# EasyEDA Pro project KOBE_FOC.epro, board KOBE_PCB_2
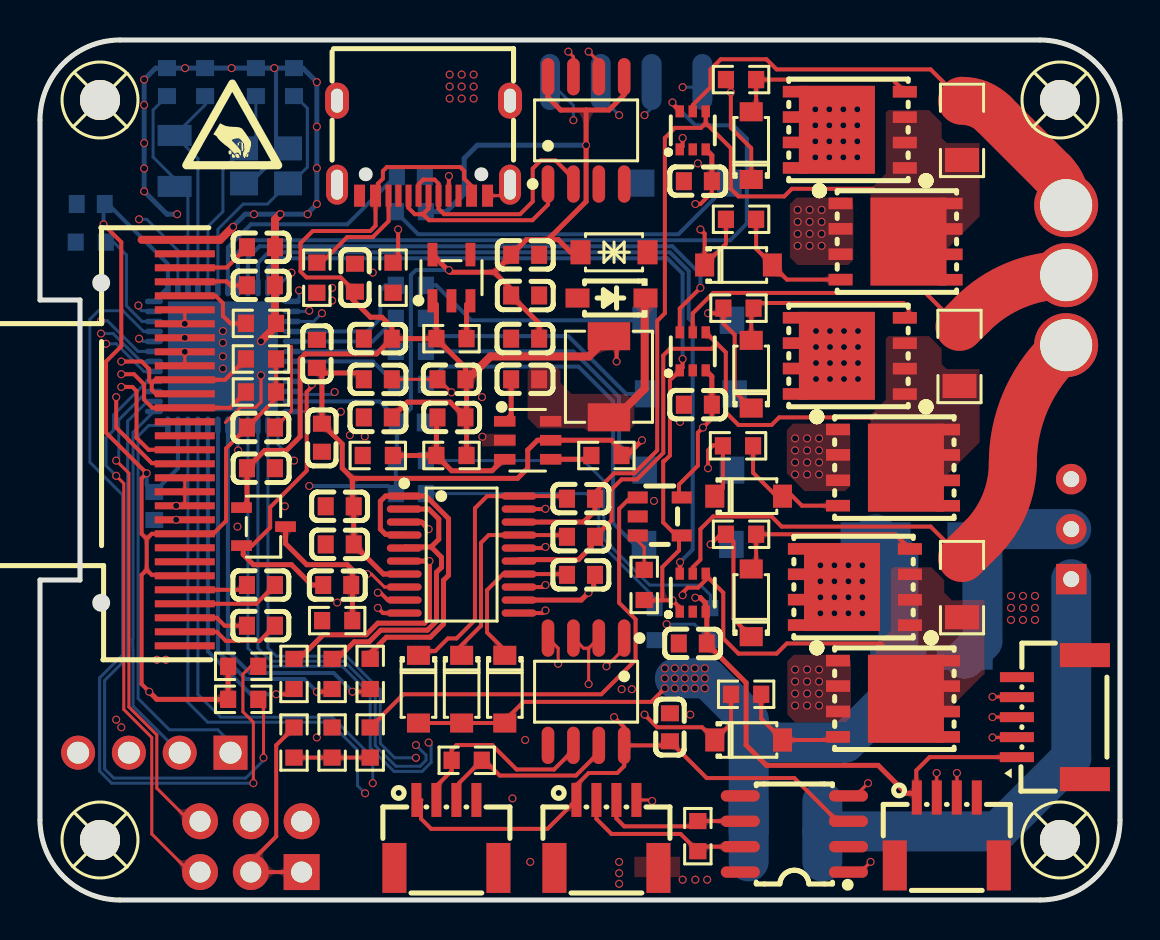
[diagram p1: board, top side]
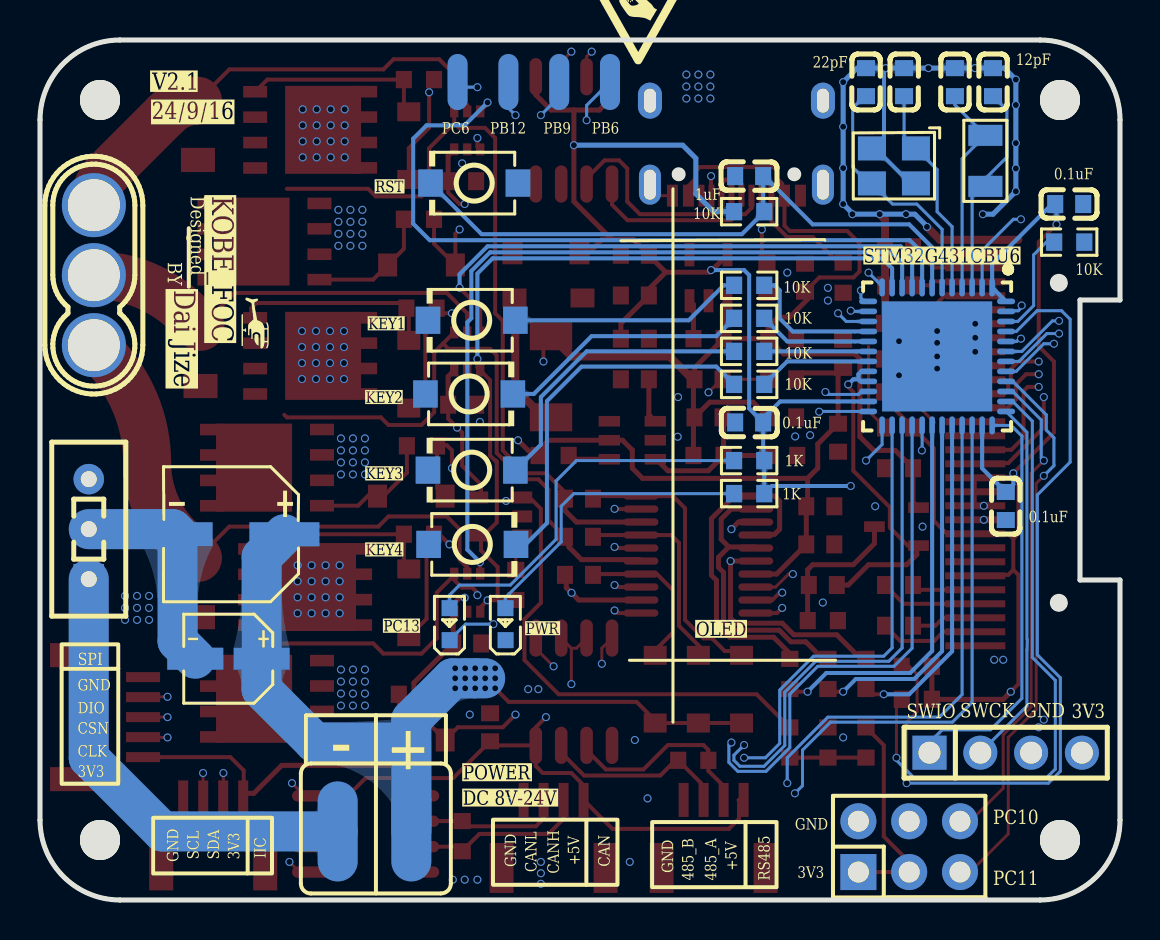
[diagram p2: board, bottom side, seen from below]

Outline 54 x 43 mm; copper layers: Top Layer, Inner1, Inner2, Bottom Layer. Coordinates in mm from the lower left corner of the outline.
Outline path: 0,39 0,30 2,30 2,16 0,16 0,4 arc(1.17,1.17) 4,0 50,0 arc(52.83,1.17) 54,4 54,39 arc(52.83,41.83) 50,43 4,43 arc(1.17,41.83) 0,39
Stack: Top Layer 0.035mm 外层铜厚1oz / Dielectric1 0.48mm 7628 RC49% 8.6mil / Inner1 0.035mm 内层铜厚 / Dielectric2 0.48mm 1.1mm H/HOZ 含铜 / Inner2 0.035mm 内层铜厚 / Dielectric3 0.48mm 7628 RC49% 8.6mil / Bottom Layer 0.035mm 外层铜厚1oz

## Design rules (mm)
template: 自定义配置
spacing copperThickness1oz (default): track to track 0.102, other pairs 0.152 to 0.3
spacing copperThickness2oz: track to track 0.203, other pairs 0.152 to 0.3
track width copperThickness1oz (default): min 0.127, default 0.254, max 2.54
track width copperThickness2oz: min 0.203, default 0.254, max 2.54
differential pair differentialPair (default): width min 0.127, default 0.254, max 2.54; gap min 0.152, default 0.152
via viaSize (default): diameter min 0.4, default 0.4, max 10; hole min 0.3, default 0.3, max 6.3

## Placement (name value [footprint] x y rotation side)
C1  1uF  [C0603]  16.89 28.07 0 top
C2  100nF  [C0603]  15.75 31.11 270 top
C3  100nF  [C0603]  24.26 30.23 180 top
C4  100nF  [C0603]  14.86 15.75 180 top
C5  100nF  [C0603]  11.05 21.59 180 top
C6  100nF  [C0603]  24.26 32.26 180 top
C7  1uF  [C0603]  11.05 13.72 0 top
C8  1uF  [C0603]  11.05 15.75 0 top
C9  1uF  [C0603]  11.05 23.62 0 top
C10  2.2uF  [C0603]  11.05 30.73 180 top
C11  2.2uF  [C0603]  11.05 32.64 180 top
C12  100nF  [C0603]  31.5 8.64 270 top
C13  1uF  [C0603]  18.54 36.19 180 bottom
C14  12pF  [C0603]  6.35 40.89 270 bottom
C15  12pF  [C0603]  8.25 40.89 270 bottom
C16  22pF  [C0603]  10.79 40.89 270 bottom
C17  22pF  [C0603]  12.7 40.89 270 bottom
C22  1uF  [C0603]  24.26 28.07 0 top
C27  100uF  [CAP-SMD_BD6.3-L6.6-W6.6-LS7.2-FD]  44.45 18.29 0 bottom
C28  10uF  [CAP-SMD_BD4.0-L4.3-W4.3-LS5.0-FD]  44.58 12.06 0 bottom
C29  100nF  [C0603]  14.1 23.11 90 top
C30  4.7uF  [C0603]  13.84 27.31 270 top
C31  100nF  [C0603]  27.05 20.07 0 top
C32  100nF  [C0603]  27.05 18.16 0 top
C33  100nF  [C0603]  27.05 16.26 0 top
C34  100nF  [C0603]  14.99 19.69 0 top
C35  100nF  [C0603]  14.99 17.78 0 top
C36  100nF  [C0603]  32.89 35.94 0 top
C37  100nF  [C0603]  32.89 24.77 0 top
C38  100nF  [C0603]  32.64 12.83 0 top
C39  100nF  [C0603]  20.57 26.03 0 top
C48  1uF  [C0603]  24.26 26.03 0 top
C49  47pF  [C0603]  20.57 24.13 180 top
C50  22uF  [C0603]  16.89 24.13 180 top
C51  2.2uF  [C0603]  16.89 26.03 180 top
C52  100nF  [C0603]  2.54 34.8 180 bottom
C53  100nF  [C0603]  18.54 23.88 0 bottom
C54  100nF  [C0603]  5.71 19.7 90 bottom
CN2  WAFER-SH1.0-4PWB  [CONN-SMD_4P-P1.00_WAFER-SH1.0-4PWB]  45.34 3.43 0 top
CN3  WAFER-SH1.0-4PWB  [CONN-SMD_4P-P1.00_WAFER-SH1.0-4PWB]  20.32 3.3 0 top
CN4  WAFER-SH1.0-4PWB  [CONN-SMD_4P-P1.00_WAFER-SH1.0-4PWB]  28.32 3.3 0 top
D1  SMFJ3.3CA  [SOD-123_L2.7-W1.6-LS3.7-BI]  28.7 32.39 180 top
D2  1N4148W  [SOD-123_L2.8-W1.8-LS3.7-RD]  34.93 31.75 0 top
D3  1N4148W  [SOD-123_L2.8-W1.8-LS3.7-RD]  35.56 37.72 90 top
D4  1N4148W  [SOD-123_L2.8-W1.8-LS3.7-RD]  35.56 26.29 90 top
D5  1N4148W  [SOD-123_L2.8-W1.8-LS3.7-RD]  35.43 20.19 0 top
D6  1N4148W  [SOD-123_L2.8-W1.8-LS3.7-RD]  35.56 14.86 90 top
D7  1N4148W  [SOD-123_L2.8-W1.8-LS3.7-RD]  35.43 8 0 top
D8  FR107  [SOD-123_L2.8-W1.8-LS3.7-RD]  23.24 10.54 270 top
D9  FR107  [SOD-123_L2.8-W1.8-LS3.7-RD]  21.08 10.54 270 top
D10  FR107  [SOD-123_L2.8-W1.8-LS3.7-RD]  18.92 10.54 270 top
D11  1N5819W  [SOD-123_L2.7-W1.6-LS3.7-RD-1]  28.57 30.1 180 top
H9  PZ254V-11-04P  [HDR-TH_4P-P2.54-V-M]  5.72 7.37 180 bottom
J1  2.54-2*3P针  [HDR-TH_6P-P2.54-V-M-R2-C3-S2.54-1]  10.54 2.67 180 bottom
L2  6.8uH  [IND-SMD_L4.4-W4.2]  28.45 26.16 270 top
LDO1  ME6211C33M5G-N  [SOT-23-5_L3.0-W1.7-P0.95-LS2.8-BL]  20.57 31.11 0 top
LED1  -  [LED_0603]  33.53 13.84 90 bottom
LED2  -  [LED_0603]  30.73 13.84 90 bottom
NOREF  -  [Pad_e129]  35.43 3.43 0 top
NOREF#2  -  [Pad_e14806]  30.58 40.9 0 top
NOREF#3  -  [Pad_e128]  39.12 3.43 0 top
NOREF#4  -  [Pad_e14808]  25.5 40.9 0 top
NOREF#5  -  [Pad_e988]  33.12 40.9 0 top
NOREF#6  -  [Pad_e14807]  28.04 40.9 0 top
OLED1  N096-2864KSWEG01-H30  [OLED_0.96-30P-P0.70-12864]  7.24 22.86 90 top
Q1  IRFH7440TRPBF  [DFN-8_L5.8-W4.9-P1.27-LS6.0-BL-1]  40.49 38.51 90 top
Q2  IRFH7440TRPBF  [DFN-8_L5.8-W4.9-P1.27-LS6.0-BL-1]  42.78 32.92 270 top
Q3  IRFH7440TRPBF  [DFN-8_L5.8-W4.9-P1.27-LS6.0-BL-1]  40.49 27.21 90 top
Q4  IRFH7440TRPBF  [DFN-8_L5.8-W4.9-P1.27-LS6.0-BL-1]  42.65 21.62 270 top
Q5  IRFH7440TRPBF  [DFN-8_L5.8-W4.9-P1.27-LS6.0-BL-1]  40.75 15.65 90 top
Q6  IRFH7440TRPBF  [DFN-8_L5.8-W4.9-P1.27-LS6.0-BL-1]  42.65 10.06 270 top
R1  1K  [R0603]  18.54 20.32 0 bottom
R2  0Ω  [R0603]  14.86 13.97 0 top
R3  5K1  [R0603]  13.84 31.11 90 top
R4  5K1  [R0603]  17.65 31.11 90 top
R5  10K  [R0603]  11.05 25.4 0 top
R6  10K  [R0603]  11.05 27.05 0 top
R7  910K  [R0603]  11.05 28.83 180 top
R8  120R  [R0603]  21.34 6.98 0 top
R9  10K  [R0603]  18.54 34.42 0 bottom
R10  10K  [R0603]  2.54 32.89 0 bottom
R11  1K  [R0603]  18.54 21.97 0 bottom
R12  10K  [R0603]  18.54 30.73 0 bottom
R13  10K  [R0603]  18.54 27.43 0 bottom
R14  10K  [R0603]  18.54 29.08 180 bottom
R15  10K  [R0603]  18.54 25.78 180 bottom
R16  10K  [R0603]  10.16 10.03 180 top
R17  10K  [R0603]  10.16 11.68 180 top
R18  10K  [R0603]  20.57 28.07 0 top
R22  采样电阻  [R1206]  46.1 38.48 90 top
R23  10K  [R0603]  12.7 7.87 90 top
R24  10K  [R0603]  14.6 7.87 270 top
R25  采样电阻  [R1206]  45.97 27.18 90 top
R26  采样电阻  [R1206]  46.1 15.62 90 top
R27  20R  [R0603]  35.05 41.02 0 top
R28  20R  [R0603]  35.05 34.04 0 top
R29  20R  [R0603]  34.93 29.59 0 top
R30  20R  [R0603]  34.9 22.71 0 top
R31  20R  [R0603]  35.05 18.29 0 top
R32  20R  [R0603]  35.31 10.29 0 top
R33  100R  [R0603]  16.51 11.3 90 top
R34  100R  [R0603]  14.6 11.3 90 top
R35  100R  [R0603]  12.7 11.3 90 top
R36  120R  [R0603]  32.89 3.19 270 top
R39  5.1kΩ  [R0603]  20.57 22.22 180 top
R40  1kΩ  [R0603]  16.89 22.22 0 top
R41  1MΩ  [R0603]  28.32 22.22 180 top
R42  10K  [R0603]  16.51 7.87 270 top
R43  10K  [R0603]  30.21 15.75 90 top
SW1  TS-1088R-02026  [SW-SMD_L3.9-W3.0-P4.45]  32.42 28.99 0 bottom
SW2  TS-1088R-02026  [SW-SMD_L3.9-W3.0-P4.45]  32.54 25.3 180 bottom
SW3  TS-1088R-02026  [SW-SMD_L3.9-W3.0-P4.45]  32.42 21.49 0 bottom
SW4  TS-1088R-02026  [SW-SMD_L3.9-W3.0-P4.45]  32.38 17.78 180 bottom
SW5  TS-1088R-02026  [SW-SMD_L3.9-W3.0-P4.45]  32.29 35.84 0 bottom
SW6  KH-SS12D01-G3-5.0  [SW-TH_KH-SS12D01-G3-5.0]  51.56 18.54 90 bottom
TP1  -  [M2螺丝]  3 3 0 top
TP2  -  [M2螺丝]  3 40 0 top
TP3  -  [M2螺丝]  51 3 0 top
TP4  -  [M2螺丝]  51 40 0 top
U1  EG2133  [TSSOP-20_L6.5-W4.4-P0.65-LS6.4-BL]  21.08 17.27 270 top
U2  BL3085(I47)  [SOP-8_L4.9-W3.9-P1.27-LS6.0-BL]  27.31 10.41 180 top
U4  WAFER-SH1.0-5PWB  [CONN-SMD_5P-P1.00_XUNPU_WAFER-SH1.0-5PWB]  50.55 9.14 90 top
U6  REF3033AIDBZR  [SOT-23-3_L3.0-W1.7-P0.95-LS2.9-BR]  11.18 18.67 180 top
U7  CH340N  [SOP-8_L4.9-W3.9-P1.27-LS6.0-BL]  27.31 38.48 0 top
U11  INA199A1DCKR  [SC-70-6_L2.2-W1.3-P0.65-LS2.1-BR]  32.64 27.43 270 top
U12  INA199A1DCKR  [SC-70-6_L2.2-W1.3-P0.65-LS2.1-BR]  32.64 15.37 270 top
U13  INA199A1DCKR  [SC-70-6_L2.2-W1.3-P0.65-LS2.1-BR]  32.64 38.48 270 top
U14  TJA1050T/CM,118  [SOIC-8_L5.0-W4.0-P1.27-LS6.0-BL]  37.72 3.3 90 top
U15  MR30-M  [CONN-TH_MR30-M]  51.31 31.24 90 bottom
U16  ME3116AM6G  [SOT-23-6_L2.9-W1.6-P0.95-LS2.8-BL]  24.38 22.99 270 top
U17  STM32G431CBU6  [UFQFPN-48_L7.0-W7.0-P0.50-BL-EP]  9.14 27.18 0 bottom
U18  LM321MFX  [SOT-23-5_L2.9-W1.6-P0.95-LS2.8-BL]  30.99 19.18 270 top
USB1  TYPE-C 16PIN 2MD(073)  [USB-C-SMD_TYPE-C-6PIN-2MD-073]  19.18 37.59 180 top
X1  8MHz  [OSC-SMD_4P-L3.2-W2.5-BL]  11.3 36.7 0 bottom
X2  32.768kHz  [OSC-SMD_L3.2-W1.5]  6.73 36.96 90 bottom

## Footprints (pads in the part's own frame, mm; a bottom-side part is the same pattern mirrored in y, then rotated)
C0603
  rect 0.8x0.9 smd: 1(-0.7,0) 2(0.7,0)
CAP-SMD_BD4.0-L4.3-W4.3-LS5.0-FD
  rect 2.8x1.1 smd: 1(-1.661,0) 2(1.661,0)
CAP-SMD_BD6.3-L6.6-W6.6-LS7.2-FD
  rect 3.5x1.2 smd: 1(-2.67,0) 2(2.67,0)
CONN-SMD_4P-P1.00_WAFER-SH1.0-4PWB
  rect 0.5x1.7 smd: 1(-1.5,1.7) 2(-0.5,1.7) 3(0.5,1.7) 4(1.5,1.7)
  rect 1.2x2.5 smd: 5(-2.6,-1.7) 6(2.6,-1.7)
CONN-SMD_5P-P1.00_XUNPU_WAFER-SH1.0-5PWB
  rect 0.5x1.7 smd: 1(-2,1.7) 2(-1,1.7) 3(0,1.7) 4(1,1.7) 5(2,1.7)
  rect 1.2x2.5 smd: 6(3.1,-1.7) 7(-3.1,-1.7)
CONN-TH_MR30-M
  round 3.2 hole 2.6: 1(-3.5,0) 2(0,0) 3(3.5,0)
DFN-8_L5.8-W4.9-P1.27-LS6.0-BL-1
  rect 0.58x1.2 smd: 1(-1.907,-2.75) 2(-0.637,-2.75) 3(0.632,-2.75) 4(1.903,-2.75) 5(1.907,2.75) 6(0.637,2.75) 7(-0.632,2.75) 8(-1.903,2.75)
  rect 4.4x3.8 smd: 9(0,0.646)
HDR-TH_4P-P2.54-V-M
  rect 1.7x1.7 hole 1.1: 1(-3.81,0)
  round 1.7 hole 1.1: 2(-1.27,0) 3(1.27,0) 4(3.81,0)
HDR-TH_6P-P2.54-V-M-R2-C3-S2.54-1
  rect 1.8x1.8 hole 1.05: 1(-2.54,-1.27)
  round 1.8 hole 1.05: 2(-2.54,1.27) 3(0,-1.27) 4(0,1.27) 5(2.54,-1.27) 6(2.54,1.27)
IND-SMD_L4.4-W4.2
  rect 1.4x2.12 smd: 1(2.028,0) 2(-2.028,0)
LED_0603
  rect 0.8x0.8 smd: 1(-0.851,-0.01) 2(0.75,-0.005)
M2螺丝
  round 2 hole 2: 1(0,0)
OLED_0.96-30P-P0.70-12864
  rect 0.35x3 smd: 1(-10.15,0.003) 2(-9.45,0.001) 3(-8.75,0.001) 4(-8.05,0.001) 5(-7.35,0.001) 6(-6.65,0.001) 7(-5.95,0.001) 8(-5.25,0.001) 9(-4.55,0.001) 10(-3.85,0.001) 11(-3.15,0.001) 12(-2.45,0.001) 13(-1.75,0.001) 14(-1.05,0.001) 15(-0.35,0.001) 16(0.35,0.001) 17(1.05,0.001) 18(1.75,0.001) 19(2.45,0.001) 20(3.15,0.001) 21(3.85,0.001) 22(4.55,0.001) 23(5.25,0.001) 24(5.95,0.001) 25(6.65,0.001) 26(7.35,0.001) 27(8.05,0.001) 28(8.75,-0.002) 29(9.45,-0.003) 30(10.15,-0.003)
OSC-SMD_4P-L3.2-W2.5-BL
  rect 1.4x1.2 smd: 1(-1.1,-0.875) 2(1.1,-0.875) 3(1.1,0.875) 4(-1.1,0.875)
OSC-SMD_L3.2-W1.5
  rect 1.05x1.7 smd: 1(-1.275,0) 2(1.275,0)
Pad_e128
  oval 2x5 smd far side: 1(0,0)
Pad_e129
  oval 2x5 smd far side: 1(0,0)
Pad_e988
  oval 1x2.8 smd far side: 66(0,0)
Pad_e14806
  oval 1x2.8 smd far side: 66(0,0)
Pad_e14807
  oval 1x2.8 smd far side: 67(0,0)
Pad_e14808
  oval 1x2.8 smd far side: 68(0,0)
R0603
  rect 0.806x0.864 smd: 1(-0.753,0) 2(0.753,0)
R1206
  rect 1.208x1.701 smd: 1(-1.479,0) 2(1.479,0)
SC-70-6_L2.2-W1.3-P0.65-LS2.1-BR
  rect 0.6x0.42 smd: 1(0.95,-0.65) 2(0.95,0) 3(0.95,0.65) 4(-0.95,0.65) 5(-0.95,0) 6(-0.95,-0.65)
SOD-123_L2.7-W1.6-LS3.7-BI
  rect 1x1.2 smd: 1(-1.675,0) 2(1.675,0)
SOD-123_L2.7-W1.6-LS3.7-RD-1
  rect 1.2x0.95 smd: 1(-1.7,0) 2(1.7,0)
SOD-123_L2.8-W1.8-LS3.7-RD
  rect 0.95x1.15 smd: 1(-1.692,0) 2(1.692,0)
SOIC-8_L5.0-W4.0-P1.27-LS6.0-BL
  oval 0.569x1.95 smd: 1(-1.905,-2.705) 2(-0.635,-2.705) 3(0.635,-2.705) 4(1.905,-2.705) 5(1.905,2.705) 6(0.635,2.705) 7(-0.635,2.705) 8(-1.905,2.705)
SOP-8_L4.9-W3.9-P1.27-LS6.0-BL
  oval 0.63x1.865 smd: 1(-1.905,-2.683) 2(-0.635,-2.683) 3(0.635,-2.683) 4(1.905,-2.683) 5(1.905,2.683) 6(0.635,2.683) 7(-0.635,2.683) 8(-1.905,2.683)
SOT-23-3_L3.0-W1.7-P0.95-LS2.9-BR
  rect 1.038x0.532 smd: 1(1.101,-0.95) 2(1.101,0.95) 3(-1.101,0)
SOT-23-5_L2.9-W1.6-P0.95-LS2.8-BL
  rect 0.6x1 smd: 1(-0.95,-1.1) 2(0,-1.1) 3(0.95,-1.1) 4(0.95,1.1) 5(-0.95,1.1)
SOT-23-5_L3.0-W1.7-P0.95-LS2.8-BL
  rect 0.49x1.157 smd: 1(-0.95,-1.153) 2(0,-1.153) 3(0.95,-1.153)
  rect 0.49x1.175 smd: 4(0.95,1.153) 5(-0.95,1.153)
SOT-23-6_L2.9-W1.6-P0.95-LS2.8-BL
  rect 0.532x1.072 smd: 1(-0.95,-1.149) 2(0,-1.149) 3(0.95,-1.149) 4(0.95,1.149) 5(0,1.149) 6(-0.95,1.149)
SW-SMD_L3.9-W3.0-P4.45
  rect 1.23x1.36 smd: 1(-2.185,0) 2(2.185,0)
SW-TH_KH-SS12D01-G3-5.0
  rect 1.524x1.524 hole 0.8: 1(-2.5,0)
  round 1.524 hole 0.8: 2(0,0) 3(2.5,0)
TSSOP-20_L6.5-W4.4-P0.65-LS6.4-BL
  oval 0.364x1.742 smd: 1(-2.925,-2.871) 2(-2.275,-2.871) 3(-1.625,-2.871) 4(-0.975,-2.871) 5(-0.325,-2.871) 6(0.325,-2.871) 7(0.975,-2.871) 8(1.625,-2.871) 9(2.275,-2.871) 10(2.925,-2.871) 11(2.925,2.871) 12(2.275,2.871) 13(1.625,2.871) 14(0.975,2.871) 15(0.325,2.871) 16(-0.325,2.871) 17(-0.975,2.871) 18(-1.625,2.871) 19(-2.275,2.871) 20(-2.925,2.871)
UFQFPN-48_L7.0-W7.0-P0.50-BL-EP
  oval 0.28x0.9 smd: 1(-2.751,-3.45) 2(-2.251,-3.45) 3(-1.75,-3.45) 4(-1.25,-3.45) 5(-0.749,-3.45) 6(-0.249,-3.45) 7(0.249,-3.45) 8(0.75,-3.45) 9(1.25,-3.45) 10(1.75,-3.45) 11(2.251,-3.45) 12(2.751,-3.45) 25(2.751,3.449) 26(2.251,3.449) 27(1.75,3.449) 28(1.25,3.449) 29(0.75,3.449) 30(0.249,3.449) 31(-0.249,3.449) 32(-0.749,3.449) 33(-1.25,3.449) 34(-1.75,3.449) 35(-2.251,3.449) 36(-2.751,3.449)
  oval 0.9x0.28 smd: 13(3.45,-2.751) 14(3.45,-2.251) 15(3.45,-1.75) 16(3.45,-1.25) 17(3.45,-0.75) 18(3.45,-0.249) 19(3.45,0.249) 20(3.45,0.749) 21(3.45,1.25) 22(3.45,1.75) 23(3.45,2.251) 24(3.45,2.751) 37(-3.449,2.751) 38(-3.449,2.251) 39(-3.449,1.75) 40(-3.449,1.25) 41(-3.449,0.749) 42(-3.449,0.249) 43(-3.449,-0.249) 44(-3.449,-0.75) 45(-3.449,-1.25) 46(-3.449,-1.75) 47(-3.449,-2.251) 48(-3.449,-2.751)
  rect 5.5x5.5 smd: 49(0,0)
USB-C-SMD_TYPE-C-6PIN-2MD-073
  rect 0.55x1.1 smd: 1(-3.2,2.375) 2(-2.4,2.375) 11(2.4,2.375) 12(3.2,2.375)
  rect 0.3x1.1 smd: 3(-1.75,2.375) 4(-1.25,2.375) 5(-0.75,2.375) 6(-0.25,2.375) 7(0.25,2.375) 8(0.75,2.375) 9(1.25,2.375) 10(1.75,2.375)
  oval 1.1x2 hole 0.6x1.5: 13(-4.325,1.825) 14(4.325,1.825)
  oval 1.2x1.8 hole 0.6x1.2: 13(-4.325,-2.375) 14(4.325,-2.375)

## Nets
As in the schematic, except:
IN_GND: NOREF#3.1 SW6.1
PB6: NOREF#4.68 U17.44
PB9: NOREF#6.67 U17.47
PB12: NOREF#2.66 U17.25
PC6: NOREF#5.66 U17.29
VM: C27.1 C28.1 C29.2 C30.2 C34.2 C35.2 C51.2 D8.2 D9.2 D10.2 NOREF.1 Q1.5 Q1.6 Q1.7 Q1.8 Q1.9 Q3.5 Q3.6 Q3.7 Q3.8 Q3.9 Q5.5 Q5.6 Q5.7 Q5.8 Q5.9 R41.1 U1.7 U16.5

Pads without a net: LDO1 4; TP1 1; TP2 1; TP3 1; TP4 1; U7 4; U14 5; USB1 3 9

## Via types
v1: diameter 0.4, hole 0.3, Top Layer to Bottom Layer, 262 vias

## Routing (per net, layer and track width the routed paths; a pad name or vN(x,y) marks a point on that pad's centre or on a via; arc(x,y) is an arc through that point)
1V65: length 3.8
  Top Layer w0.2: R42.2 R24.2 R23.1
+3.3V: length 229
  Top Layer w0.2: R6.2 R5.2 11.8,25.08 9.3,22.58 9.3,18.96 8.66,18.31 OLED1.9 5.59,18.31 5.33,18.06 ; 5.33,16.51 5.08,16.26 5.08,10.8 v1(5.46,10.41) ; 5.33,16.51 5.33,18.06 ; 5.33,16.51 5.59,16.26 7.19,16.26 OLED1.6 ; R23.2 11.81,7.74 11.81,3.17 10.03,1.4 12.57,1.4 ; 31.95,19.99 31.95,20.77 32.89,21.72 32.89,23.37 v1(33.15,23.62) 33.59,24.07 C37.2 ; U4.1 44.48,7.14 43.81,6.48 43.81,5.15 ; 5.33,18.06 5.08,18.31 5.08,21.08 v1(5.33,21.34) 3.3,23.37 3.3,26.92 4.06,27.69 4.06,32.89 3.3,33.66 3.17,33.66 ; v1(32.77,34.8) 33.02,34.8 33.59,35.37 C36.2
  Top Layer w0.25: v1(32.77,15.11) 33.02,15.11 33.27,14.86 33.27,14.43 33.34,14.37 C38.2 35.31,10.86 35.31,7.75 36.32,6.73 41.91,6.73 43.31,5.33 43.63,5.33 CN2.1 ; C22.2 24.96,28.83 23.56,30.23 23.56,30.55 22.71,31.39 ; LDO1.5 20.5,31.39 22.71,31.39 ; 22.71,31.39 23.56,32.23 23.56,32.26 24.32,33.02 25.4,33.02 ; 25.4,33.02 27.31,34.92 v1(27.31,37.74) 27.31,39.49 27.31,39.5 ; 25.4,33.02 25.91,33.02 26.54,32.39 D1.2 ; U7.8 25.4,40.13 26.03,39.5 27.31,39.5 ; 27.31,39.5 28.45,39.5 29.21,40.26 U7.5 ; C37.2 33.59,26.18 33.29,26.48 ; C36.2 33.59,37.23 33.29,37.53 ; R17.2 R16.2 5.84,10.03 v1(5.46,10.41)
  Inner1 w0.2: v1(13.46,20.7) 5.97,20.7 v1(5.33,21.34) ; v1(32.77,15.11) 34.04,16.38 34.04,20.07 32.95,21.16 32.95,23.42 v1(33.15,23.62) 33.15,25.02 32.38,25.78 29.08,25.78 28.19,26.67 28.19,27.43 29.08,28.32 33.53,28.32 34.54,29.34 34.54,33.02 v1(32.77,34.8) ; v1(5.46,10.41) 3.17,10.41 1.91,9.14 H9.4 1.91,6.22 5.46,2.67 8.76,2.67 10.03,1.4
  Inner1 w0.25: v1(32.77,34.8) 29.82,37.74 v1(27.31,37.74)
  Bottom Layer w0.2: v1(20.45,31.5) 18.8,31.5 18.54,31.24 18.54,24.58 C53.1 ; U17.35 6.89,21.58 C54.2 5.33,20.78 v1(5.33,21.34) ; C53.1 17.84,22.02 R11.1 R1.1 17.41,20.7 v1(13.46,20.7) ; C53.1 17.84,24.08 16.99,24.93 U17.23 ; U17.48 U17.1 6.39,31.8 3.4,34.8 3.11,34.8 3.17,34.74 v1(3.17,33.78)
  Bottom Layer w0.25: R9.2 20.32,34.42 21.21,35.31 21.21,37.08 21.87,37.74 v1(27.31,37.74)
+5V: length 117.4
  Top Layer w0.2: USB1.2 21.58,35.7 21.21,36.07 21.21,36.45 21.01,36.65 17.34,36.65 17.15,36.45 17.15,36.07 16.89,35.81 16.89,35.33 USB1.11 16.78,33.71 16.51,33.45 13.64,33.45 13.03,32.84 13.03,31.42 13.32,31.13 15.03,31.13 15.75,30.42 ; U2.8 31.29,7.73 C12.2 33.34,6.1 37.72,6.1 39.88,3.94 40.42,3.94 ; U2.8 29.21,8.64 v1(28.7,9.14) ; U2.8 29.21,6.7 28.86,6.35 27.43,6.35 26.82,5.74 CN4.1 25.38,3.56 19.56,3.56 19.05,4.06 19.05,4.98 19.07,5 ; v1(28.83,26.92) 28.83,27.81 L2.2
  Top Layer w0.25: 15.62,30.42 15.62,30.04 16.52,29.14 17.1,29.14 17.59,28.64 17.59,28.07 ; 21.33,24.08 C49.1 20.51,24.89 18.35,24.89 17.59,24.13 ; 21.33,24.08 R39.1 ; 21.33,24.08 21.33,25.98 C39.2 21.27,26.61 R18.1 ; LDO1.1 19.82,29.76 R18.1 ; 17.59,28.07 16.83,27.31 13.26,27.31 13.01,27.06 13.01,23.17 12.32,22.48 11.24,22.48 10.35,21.59 10.35,19.89 U6.1 ; 17.59,28.07 R18.1
  Top Layer w0.4: 21.33,25.98 22.52,27.18 27.44,27.18 L2.2
  Inner1 w0.2: v1(28.7,9.14) 29.21,8.64 34.04,8.64 34.8,9.4 34.8,25.4 33.91,26.29 29.46,26.29 v1(28.83,26.92)
GND: length 74.7
  Top Layer w0.15: OLED1.11 OLED1.12 OLED1.13 ; CN4.4 30.56,5 v1(30.61,4.95) ; 17.59,26.03 C39.1 19.92,26.03 v1(20.57,25.38) ; C9.2 12.57,24.45 12.57,27.69 ; v1(7.24,27.41) OLED1.21 ; 9.27,23.88 10.03,24.64 10.79,24.64 11.05,24.89 v1(11.05,26.23) ; USB1.13 22.95,35.22 USB1.1 ; v1(16.36,16.3) 16.57,16.3 17.22,15.65 18.21,15.65 ; v1(7.24,28.81) OLED1.25
  Top Layer w0.4: v1(9.65,33.66) 9.01,33.01 OLED1.30 5.08,33.01 ; v1(11.05,27.94) 11.75,28.64 C10.1 C11.1 11.75,34.02 v1(12.02,34.29)
  Bottom Layer w0.2: v1(11.71,41.59) 11.8,41.51 11.8,37.15 10.72,36.07
  Bottom Layer w0.25: v1(6.86,34.29) 6.35,34.29 v1(5.21,35.43) v1(5.21,36.58) v1(5.21,37.85) v1(5.21,39.75) v1(5.21,41.02) 5.78,41.59 C14.1 v1(7.25,41.59) C15.1 v1(9.58,41.59) C16.1 v1(11.71,41.59) C17.1 13.14,41.59 v1(13.84,40.89) v1(13.84,38.66) v1(13.84,36.59) v1(13.84,34.8) 13.34,34.29 v1(12.02,34.29) v1(10.7,34.29) 10.26,34.29 9.65,33.68 v1(9.65,33.66)
  Bottom Layer w2: SW6.2 47.37,18.54 C27.2 47.12,12.95 C28.2
  vias: v1(3.81,9.02) v1(4.06,8.64) v1(5.84,12.01) v1(6.29,12.01) v1(6.81,19.71) v1(6.81,19.01) v1(7.24,28.11) v1(9.14,28.45) v1(9.14,27.86) v1(9.14,27.18) v1(9.14,26.57) v1(9.87,18.67) v1(12.24,19.69) v1(13.38,34.29) v1(13.84,8.13) v1(14.6,30.61) v1(14.6,29.97) v1(14.86,14.87) v1(15.49,23.24) v1(16.24,23.18) v1(16.64,31.37) v1(20.48,41.27) v1(20.48,40.67) v1(20.48,40.07) v1(21.08,41.27) v1(21.08,40.67) v1(21.08,40.07) v1(21.68,41.27) v1(21.68,40.67) v1(21.68,40.07) v1(22.1,25.15) v1(22.12,23.16) v1(23.62,5.08) v1(24.26,8) v1(24.51,1.91) v1(28.96,1.91) v1(28.96,1.34) v1(28.96,0.81) v1(29.08,10.54) v1(29.59,10.54) v1(30.7,19.95) v1(32,23.9) v1(32.13,1.02) v1(32.51,9.27) v1(32.77,1.02) v1(32.89,36.83) v1(33.36,1.02) v1(37.75,23.08) v1(37.75,22.48) v1(37.75,21.88) v1(37.75,21.28) v1(37.75,11.52) v1(37.75,10.92) v1(37.75,10.32) v1(37.75,9.72) v1(37.88,34.51) v1(37.88,33.91) v1(37.88,33.31) v1(37.88,32.71) v1(38.35,23.08) v1(38.35,22.48) v1(38.35,21.88) v1(38.35,21.28) v1(38.35,11.52) v1(38.35,10.92) v1(38.35,10.32) v1(38.35,9.72) v1(38.48,34.51) v1(38.48,33.91) v1(38.48,33.31) v1(38.48,32.71) v1(38.95,23.08) v1(38.95,22.48) v1(38.95,21.88) v1(38.95,21.28) v1(38.95,11.52) v1(38.95,10.92) v1(38.95,10.32) v1(38.95,9.72) v1(39.08,34.51) v1(39.08,33.91) v1(39.08,33.31) v1(39.08,32.71) v1(48.55,15.2) v1(48.55,14.61) v1(48.55,14) v1(49.15,15.2) v1(49.15,14.61) v1(49.15,14) v1(49.75,15.2) v1(49.75,14.61) v1(49.75,14)
VDDA: length 16.9
  Top Layer w0.2: v1(13.59,25.78) 13.59,25.65 13.34,25.4 13.34,21.46 11.51,19.63 11.51,18.62 10.61,17.72 U6.2
  Top Layer w0.25: C4.2 13.59,15.75 12.57,16.76 10.67,16.76 10.16,17.27 10.16,17.63 U6.2
  Bottom Layer w0.2: 13.08,26.03 12.97,25.93 U17.21 ; 13.08,26.03 13.08,26.29 12.94,26.43 U17.20 ; 13.08,26.03 13.34,26.03 v1(13.59,25.78)
VSSA: length 7.4
  Top Layer w0.25: U6.3 12.28,17.82 13.34,16.76 15.37,16.76 15.62,16.51 15.62,15.81 ; 15.62,15.81 C4.1 ; 15.62,15.81 15.62,13.98 R2.2
485_A: length 10.6
  Top Layer w0.2: 19.81,4.74 19.81,5.69 20.58,6.46 R8.1 20.58,7.5 20.83,7.75 22.61,7.75 23.83,6.53 25.7,6.53 26.8,7.62 26.8,7.86
485_B: length 9.8
  Top Layer w0.2: 28.07,7.86 28.07,7.49 26.8,6.22 22.99,6.22 22.22,6.98 R8.2 20.96,5.85 20.96,4.88
A: length 23.8
  Top Layer w0.2: U13.5 32.64,39.75 33.53,40.64 33.53,41.53 34.04,42.04 36.32,42.04 36.83,41.53 44.53,41.53 R22.2
  Top Layer w2.4: R22.2 arc(46.96,39.79) 47.7,39.3 50.64,36.36 arc(51.13,35.61) U15.3
A+: length 38.9
  Top Layer w0.2: 33.29,38.85 33.05,38.61 31.75,38.61 31.24,38.1 31.24,29.34 30.86,28.96 30.86,22.48 29.72,21.34 28.7,21.34 27.75,20.39 27.75,20.07 ; 33.29,38.85 33.29,39.43 ; 33.29,38.85 34.54,37.59 34.54,35.56 34.93,35.18 37.21,35.18 37.59,35.56 41.66,35.56
  Top Layer w0.25: U1.18 27.18,18.9 27.75,19.47 27.75,20.07
ADC_REF: length 53.5
  Top Layer w0.2: R43.1 30.22,14.99 31.12,14.99 ; v1(32.13,38.1) 32.13,37.67 31.99,37.53 ; v1(32.13,27.05) 32.13,26.62 U11.1 31.5,25.99 31.5,22.22 31.24,21.97 31.21,21.97 31.16,21.92 31.16,18.88 31.95,18.09 31.95,17.48 31.12,16.64 31.12,14.99 ; 31.12,14.99 v1(31.62,14.99) 31.99,14.62 U12.1
  Inner2 w0.2: v1(32.13,38.1) v1(32.13,27.05)
  Bottom Layer w0.2: v1(32.13,27.05) 32.13,31.32 31.37,32.08 11.89,32.08 11.39,31.59 U17.11
B: length 21.5
  Top Layer w0.2: R25.2 44.28,30.35 33.66,30.35 32.64,29.34 U11.5
  Top Layer w2.4: R25.2 46.62,29.3 arc(48.77,30.74) U15.2
B+: length 30.7
  Top Layer w0.2: 27.75,18.16 28.57,18.98 28.57,20.53 29.08,21.03 29.84,21.03 31.16,22.35 31.16,27.23 31.5,27.56 33.58,27.56 33.85,27.82 ; 33.85,27.82 34.29,27.38 34.29,24.38 34.93,23.75 36.58,23.75 36.96,24.13 41.66,24.13 41.78,24.26 ; 33.85,27.82 33.29,28.38
  Top Layer w0.25: U1.15 24.02,17.02 26.92,17.02 27.56,17.65 27.56,17.97 27.75,18.16
BOOT0: length 5.5
  Bottom Layer w0.15: U17.46 5.11,28.93 4.32,29.72 4.32,32.26 3.68,32.89 R10.2
BS: length 2.2
  Top Layer w0.25: 23.56,26.03 23.56,24.26 23.24,23.94
C: length 28.8
  Top Layer w0.2: U12.5 32.64,16.64 33.02,17.02 33.02,18.54 33.66,19.18 36.58,19.18 37.08,18.67 44.53,18.67 R26.2
  Top Layer w2.4: U15.1 50.93,27.36 arc(49.23,24.83) 48.64,21.84 arc(48.24,19.81) 47.08,18.08 R26.2
C1N: length 3.2
  Top Layer w0.2: OLED1.5 10.11,15.51 10.35,15.75
C1P: length 4.9
  Top Layer w0.2: C8.2 10.81,14.81 OLED1.4
C2N: length 3.3
  Top Layer w0.2: 10.35,13.72 9.23,13.72 8.84,14.11 OLED1.3
C2P: length 5
  Top Layer w0.2: OLED1.2 8.84,13.41 9.29,12.95 10.99,12.95 C7.2
C+: length 23.5
  Top Layer w0.2: 33.29,16.32 33.29,16.24 ; 33.29,16.24 34.16,15.37 34.16,13.08 34.93,12.32 36.83,12.32 37.34,12.83 42.04,12.83 42.16,12.7 ; 33.29,16.24 33.29,16 32.91,15.62 32.38,15.62 32.13,15.37 v1(32.13,15.24)
  Top Layer w0.25: 27.75,16.26 27.69,16.19 27.69,15.62 v1(27.42,15.36) 27.06,15 U1.12
  Inner1 w0.2: v1(32.13,15.24) 31.88,15.49 31.37,15.49 31.23,15.36 v1(27.42,15.36)
CAN_RXD: length 51
  Top Layer w0.15: U14.4 40.77,5.21 v1(41.4,5.84)
  Inner1 w0.15: v1(16.64,5.84) 16.89,6.1 41.15,6.1 v1(41.4,5.84)
  Bottom Layer w0.15: U17.33 7.89,10.28 9.03,9.14 14.61,9.14 16.64,7.11 v1(16.64,5.84)
CAN_TXD: length 55.9
  Top Layer w0.15: 40.42,1.4 41.02,1.4 v1(41.53,1.91)
  Inner1 w0.15: v1(41.53,1.91) 41.53,4.95 40.64,5.85 17.25,5.85 16.73,5.33 v1(16.26,5.33)
  Bottom Layer w0.15: v1(16.26,5.33) 15.88,5.72 15.88,7.49 14.48,8.89 8.38,8.89 7.39,9.88 U17.34
CANH: length 8.9
  Top Layer w0.2: CN4.2 27.82,4.06 28.57,3.3 32.03,3.3 R36.2 33.12,2.67 U14.7
CANL: length 7.4
  Top Layer w0.2: CN4.3 28.82,4.07 29.21,3.68 32.63,3.68 R36.1 35.01,3.95 35.01,3.94
CC1: length 7.2
  Top Layer w0.2: USB1.4 20.45,35.24 v1(20.45,36.19) ; v1(17.91,33.53) 17.91,32.12 R4.2
  Inner1 w0.2: v1(17.91,33.53) 19.18,33.53 20.43,34.78 20.43,36.18
CC2: length 5.3
  Top Layer w0.2: USB1.10 17.43,33.94 16.64,33.15 15.36,33.15 14.21,32
CE: length 2
  Top Layer w0.25: R18.2 21.33,29.76 LDO1.3
D/R: length 48.7
  Top Layer w0.15: 27.43,12.59 U2.2 ; 27.43,12.59 v1(27.43,10.8) ; 27.43,12.59 27.18,12.59 U2.3
  Inner1 w0.15: v1(27.43,10.8) 27.18,11.05 4.95,11.05 4.01,12 4.07,15.02 2.79,16.29 2.79,26.8 2.41,27.18 2.41,28.47 2.9,28.96 v1(3.05,28.96)
  Bottom Layer w0.15: v1(3.05,28.96) 3.38,28.96 4.91,27.43 5.69,27.43
DCEN: length 2.1
  Top Layer w0.25: U16.4 27.38,22.04 R41.2
DCFB: length 8.1
  Top Layer w0.25: 23.24,22.04 23.18,22.04 22.61,21.46 20.58,21.46 R39.2 ; R39.2 R40.2 ; R39.2 19.82,24.08 C49.2
DN: length 12.6
  Top Layer w0.2: U7.2 26.54,35.93 26.54,36.21 25.77,36.98 25.05,36.98 24.64,36.58 24.64,34.92 24,34.29 20.2,34.29 19.93,34.57 USB1.5 19.93,35.82 19.73,36.02 19.16,36.02 18.93,35.79 USB1.7
DP: length 10.2
  Top Layer w0.2: 19.15,34.29 19.45,33.99 24.62,33.99 25.4,34.77 U7.1 ; 19.15,34.29 18.74,34.29 18.41,34.61 18.41,35.2 USB1.8 ; 19.15,34.29 19.43,34.57 USB1.6
GH1: length 9.4
  Top Layer w0.2: D3.2 35.81,39.66 R27.2 42.63,41.02 Q1.4
GH2: length 10.2
  Top Layer w0.2: Q3.4 43.43,29.3 43.43,29.59 43.18,29.85 35.94,29.85 R29.2 35.56,29.47 D4.2
GH3: length 9.8
  Top Layer w0.2: Q5.4 42.76,18.29 R31.2 35.81,16.8 D6.2
GL1: length 6.3
  Top Layer w0.2: R28.2 35.81,32.56 D2.2 37.35,31.02 Q2.4
GL2: length 6.1
  Top Layer w0.2: 37.39,20.42 38.09,19.72 Q4.4 ; R30.2 35.65,21.36 36.82,20.19 D5.2
GL3: length 5.6
  Top Layer w0.2: R32.2 36.06,9.07 D7.2 39.74,8 Q6.4
HO1: length 34.8
  Top Layer w0.2: U1.19 25.26,19.55 v1(25.27,19.56) ; D3.1 35.56,37.59 34.54,38.61 v1(34.54,40.39) 34.54,40.78 R27.1
  Inner1 w0.2: v1(34.54,40.39) 32.71,38.55 27.12,38.55 25.72,37.15 25.72,20.01 v1(25.27,19.56)
HO2: length 35.2
  Top Layer w0.2: D4.1 34.73,25.42 34.73,28.26 34.17,28.82 R29.1 33.92,29.34 v1(33.4,29.34) ; v1(25.27,17.65) 25.22,17.6 23.95,17.6
  Inner1 w0.2: v1(33.4,29.34) 27.56,29.34 26.33,28.11 26.33,13.92 26.13,13.72 25.02,13.72 24.82,13.92 24.82,17.2 v1(25.27,17.65)
HO3: length 28.3
  Top Layer w0.2: D6.1 34.67,14.06 34.67,17.92 R31.1 34.04,18.29 v1(33.53,17.78) ; v1(25.27,15.75) 25.17,15.65 U1.13
  Inner1 w0.2: v1(33.53,17.78) 27.56,17.78 26.63,16.85 26.63,13.79 26.25,13.41 24.9,13.41 24.52,13.79 24.52,17.54 25.09,18.11 25.46,18.11 25.73,17.84 25.73,16.2 v1(25.27,15.75)
IA: length 37.1
  Top Layer w0.2: U13.6 31.62,39.8 v1(31.62,39.88)
  Bottom Layer w0.2: U17.8 9.89,32.37 10.51,32.99 34.51,32.99 35.34,33.82 35.34,38.06 34.67,38.73 32.77,38.73 v1(31.62,39.88)
IB: length 28.3
  Top Layer w0.2: U11.6 31.99,29.58 v1(33.02,30.61)
  Bottom Layer w0.2: v1(33.02,30.61) 33.02,31.29 31.62,32.69 10.97,32.69 10.39,32.11 U17.9
IC: length 38.9
  Top Layer w0.2: v1(32,16.89) 32,16.33 U12.6
  Bottom Layer w0.2: U17.10 10.89,31.85 11.43,32.39 31.5,32.39 32.43,31.45 32.43,29.08 32.63,28.88 32.63,17.52 v1(32,16.89)
IN1: length 16.9
  Top Layer w0.25: 18.21,18.25 18.17,18.29 17.27,18.29 17.02,18.54 17.02,19.94 17.28,20.2 19.3,20.2 20.43,19.07 20.43,16.24 20.18,15.99 20.18,13.8 19.51,13.14 17.32,13.14 16.51,12.33 16.51,11.8
IN2: length 15
  Top Layer w0.25: 19.56,17.65 18.27,17.65 18.21,17.6 ; 19.56,17.65 19.94,18.03 19.94,19.05 19.44,19.55 18.21,19.55 ; 19.56,17.65 20.07,17.14 20.07,16.63 19.82,16.38 19.82,13.95 19.37,13.49 17.04,13.49 16.46,12.91 15.71,12.91 14.6,11.8
IN3: length 14.8
  Top Layer w0.25: 18.21,16.95 v1(19.47,16.95) 19.47,14.09 19.22,13.84 16.89,13.84 16.31,13.26 14.16,13.26 12.7,11.8 ; 18.21,18.9 19.08,18.9 v1(19.43,18.54)
  Inner1 w0.2: v1(19.47,16.95) 19.43,16.99 v1(19.43,18.54)
IN_GND: length 22.9
  Bottom Layer w2: NOREF#3.1 47.88,3.43 51.56,7.11 SW6.1
K1: length 11.7
  Bottom Layer w0.2: SW1.1 21.56,28.99 19.81,30.73 R12.2
K2: length 12.6
  Bottom Layer w0.2: R14.1 20.18,28.19 26.42,28.19 29.31,25.3 SW2.2
K3: length 14.8
  Bottom Layer w0.2: SW3.1 28.96,22.77 28.96,25.15 26.67,27.43 R13.2
K4: length 18.9
  Bottom Layer w0.2: R15.1 20.18,26.67 26.92,26.67 28.65,24.94 28.65,18.84 29.72,17.78 30.39,17.78 30.49,17.68
KEY1: length 7
  Bottom Layer w0.2: R12.1 17.27,30.73 17.02,30.48 17.02,29.08 16.36,28.43 U17.16
KEY2: length 5.7
  Bottom Layer w0.2: U17.17 16.63,27.93 R14.2
KEY3: length 5.2
  Bottom Layer w0.2: 12.59,27.43 12.6,27.43 R13.1
KEY4: length 5.7
  Bottom Layer w0.2: U17.19 16.64,26.93 R15.2
LD1: length 19.4
  Bottom Layer w0.15: LED1.2 33.52,15.25 33.02,15.75 30.48,15.75 28.19,18.03 28.19,20.95 27.18,21.97 R11.2
LD2: length 15.2
  Bottom Layer w0.15: R1.2 27.31,20.32 27.94,19.69 27.94,17.91 30.73,15.12 LED2.2
LED1: length 52.2
  Inner2 w0.15: v1(4.95,34.04) 5.97,33.02 13.34,33.02 14.35,34.04 26.67,34.04 27.69,33.02 27.69,16.51 30.4,13.79 v1(31.33,13.79)
  Bottom Layer w0.15: U17.2 6.89,32.48 5.33,34.04 v1(4.95,34.04) ; v1(31.33,13.79) 32.72,13.79 LED1.1
LM+: length 23.5
  Top Layer w0.2: R42.1 18.17,10.29 28.07,10.29 29.78,12 29.78,14.04 28.96,14.86 28.96,19.56 29.39,19.99 29.75,19.99
LM-: length 1.8
  Top Layer w0.15: 29.75,18.09 30.21,17.63 R43.2
LO1: length 31.4
  Top Layer w0.2: v1(33.02,33.53) 33.23,33.32 D2.1 34.3,32.82 R28.1 ; v1(25.27,14.48) 25.14,14.35 U1.11
  Inner1 w0.2: v1(25.27,14.48) 25.4,14.48 26.03,15.11 26.03,31.87 27.69,33.53 v1(33.02,33.53)
LO2: length 35
  Top Layer w0.2: 18.21,14.35 17.15,14.35 v1(16.89,14.61) ; D5.1 34.15,20.6 R30.1 34.12,22.73 33.66,22.73 33.4,22.48 v1(33.4,21.59)
  Inner1 w0.2: v1(33.4,21.59) 34.5,20.5 34.5,15.32 32.13,12.95 18.54,12.95 17.7,13.79 17.7,15.32 17.2,15.82 16.7,15.82 16.38,15.5 16.38,15.11 v1(16.89,14.61)
LO3: length 26.3
  Top Layer w0.2: R32.1 34.55,8.81 D7.1 33.11,8.64 30.86,8.64 v1(30.23,9.27) ; 18.21,15 17.39,15 17.02,15.37 v1(16.89,15.37)
  Inner1 w0.2: v1(16.89,15.37) 17.4,14.86 17.4,13.59 18.34,12.65 29.51,12.65 30.23,11.94 v1(30.23,9.27)
OIREF: length 4
  Top Layer w0.2: R7.2 9.53,28.83 9.14,29.21 9.14,29.84 8.78,30.21 OLED1.26
OLED_D/C: length 21.1
  Top Layer w0.2: OLED1.15 5.43,22.51 4.83,23.11 4.83,25.45 4.62,25.65 v1(4.06,25.65)
  Inner1 w0.15: v1(12.57,31.37) 4.72,31.37 3.73,30.38 3.73,27.22 3.56,27.05 3.56,26.19 4.06,25.68 v1(4.06,25.65)
  Bottom Layer w0.15: v1(12.57,31.37) 11.9,30.69 U17.12
OLED_RES: length 22.1
  Top Layer w0.2: OLED1.14 7.2,21.84 5.59,21.84 3.81,23.62 v1(3.81,25.15)
  Inner1 w0.15: v1(3.81,25.15) 4.31,25.15 4.85,25.69 4.85,27.28 4.48,27.65 4.48,30.06 5.03,30.61 11.71,30.61 12.85,29.46 v1(13.46,29.46)
  Bottom Layer w0.15: v1(13.46,29.46) 13.43,29.43 U17.14
OLED_SCLK: length 21.9
  Top Layer w0.2: v1(4.06,26.29) 4.7,26.29 5.21,25.78 5.21,25.02 5.62,24.61 OLED1.18 9.51,24.61 R5.1
  Inner1 w0.15: v1(12.95,30.48) 12.83,30.61 12.06,30.61 11.81,30.86 4.93,30.86 4.23,30.17 4.23,27.52 4.59,27.16 4.59,26.82 v1(4.06,26.29)
  Bottom Layer w0.15: U17.13 12.78,29.93 12.95,30.1 v1(12.95,30.48)
OLED_SDIO: length 26.6
  Top Layer w0.2: v1(4.06,26.92) 5.08,26.92 5.46,26.54 5.46,25.96 5.59,25.83 ; 5.59,25.83 5.59,25.51 5.79,25.31 OLED1.19 ; 5.59,25.83 5.79,26.03 7.21,26.03 OLED1.20 9.25,26.01 R6.1
  Inner1 w0.15: v1(14.1,29.34) 14.1,30.48 13.59,30.99 12.83,30.99 12.7,30.86 12.32,30.86 12.06,31.11 4.83,31.11 3.98,30.27 3.98,27.01 v1(4.06,26.92)
  Bottom Layer w0.15: U17.15 13.69,28.93 v1(14.1,29.34)
OSC32_IN: length 10.2
  Bottom Layer w0.15: 7.39,35.4 U17.3 ; C14.2 5.65,39.5 5.65,37.15 6.73,36.07 X2.1 6.89,35.53
OSC32_OUT: length 10.7
  Bottom Layer w0.15: U17.4 7.89,37.07 X2.2 8.25,39.76 C15.2
OSC_IN: length 10.6
  Bottom Layer w0.15: U17.5 8.4,33.67 9.14,34.42 9.14,36.52 X1.1 10.79,38.17 C16.2
OSC_OUT: length 12
  Bottom Layer w0.15: 12.81,40.14 13.37,39.59 13.37,36.64 12.71,35.98 ; U17.6 8.9,33.53 10.16,34.8 11.37,34.8 X1.3
OVC: length 3.5
  Top Layer w0.2: 10.35,32.64 9.33,31.62 7.25,31.62 OLED1.28
PB6: length 47.1
  Inner1 w0.15: v1(26.67,38.99) 26.03,38.99 25.4,38.35 25.4,22.99 23.62,21.21 6.73,21.21 5.72,22.22 5.72,27.31 v1(4.95,28.07)
  Bottom Layer w0.15: v1(26.67,38.99) 26.67,39.73 NOREF#4.68 ; v1(4.95,28.07) 5.03,28.07 5.17,27.93 U17.44
PB9: length 50.9
  Inner1 w0.15: v1(4.92,29.73) 5.97,28.68 5.97,22.35 6.86,21.46 23.52,21.46 25.15,23.09 25.15,38.46 26.44,39.75 28.45,39.75 v1(28.96,39.24)
  Bottom Layer w0.15: U17.47 5.66,29.46 5.08,29.46 4.92,29.63 v1(4.92,29.73) ; NOREF#6.67 28.04,40.16 v1(28.96,39.24)
PB12: length 38.4
  Inner1 w0.15: v1(30.23,39.24) 29.47,40 26.34,40 24.9,38.56 24.9,23.2 23.42,21.72 12.95,21.72 v1(12.7,21.97)
  Bottom Layer w0.15: v1(12.7,21.97) 11.9,22.78 U17.25 ; v1(30.23,39.24) 30.58,39.6 NOREF#2.66
PC6: length 41.5
  Inner1 w0.15: v1(32.13,40.64) 31.8,40.31 26.28,40.31 24.64,38.67 24.64,23.3 23.31,21.97 13.46,21.97 12.95,22.48 v1(9.91,22.48)
  Bottom Layer w0.15: v1(32.13,40.64) 32.86,40.64 NOREF#5.66 ; U17.29 9.89,22.49 v1(9.91,22.48)
PC10: length 24
  Top Layer w0.15: v1(3.81,21.97) 4.44,21.34 4.44,9.65 5.84,8.26 5.84,5.59 7.49,3.94
  Bottom Layer w0.15: v1(3.81,21.97) 3.94,22.1 3.94,24 5.36,25.43 U17.39
PC11: length 27.5
  Top Layer w0.15: 7.49,1.4 5.59,3.3 5.59,8.13 4.19,9.53 4.19,20.83 v1(3.81,21.21)
  Bottom Layer w0.15: v1(3.81,21.21) 3.3,21.72 3.3,23.11 3.68,23.5 3.68,24.26 5.35,25.93 U17.40
PWM_A: length 19.3
  Top Layer w0.2: 16.51,10.3 16.39,10.41 v1(15.62,10.41)
  Bottom Layer w0.2: U17.30 9.39,12.45 10.49,11.35 14.68,11.35 v1(15.62,10.41)
PWM_B: length 17.9
  Top Layer w0.2: 14.6,10.3 14.49,10.41 v1(13.84,10.41)
  Bottom Layer w0.2: U17.31 8.9,12.44 10.29,11.05 13.21,11.05 v1(13.84,10.41)
PWM_C: length 16.5
  Top Layer w0.2: 12.7,10.3 12.69,10.29 v1(11.81,10.29)
  Bottom Layer w0.2: U17.32 8.4,12.43 10.54,10.29 v1(11.81,10.29)
RST: length 31.8
  Bottom Layer w0.2: 17.72,36.13 15.37,33.78 10.54,33.78 9.39,32.63 U17.7 ; SW5.2 31.92,33.29 18.91,33.29 17.79,34.41 R9.1 17.84,34.47 C13.2
RXD_2: length 46.4
  Top Layer w0.15: U2.1 29.21,12.57 v1(28.32,11.68)
  Inner1 w0.15: v1(28.32,11.68) 27.94,11.3 5.06,11.3 4.32,12.04 4.32,15.12 3.05,16.39 3.05,26.92 2.87,27.1 2.87,28.15 v1(3.05,28.32)
  Bottom Layer w0.15: U17.42 5.05,26.93 3.66,28.32 v1(3.05,28.32)
RXD_3: length 32.4
  Top Layer w0.15: U7.6 27.94,41.91 v1(27.43,42.42)
  Inner1 w0.15: v1(15.04,24.41) 15.37,24.74 15.37,33.43 17.27,35.33 17.27,41.4 17.86,41.99 27,41.99 v1(27.43,42.42)
  Bottom Layer w0.15: v1(15.04,24.41) 15.03,24.43 U17.24
SCL: length 67.7
  Top Layer w0.15: v1(11.18,7.11) 11.18,9.77 R16.1 ; CN2.3 45.85,5.14 v1(45.85,6.35)
  Inner1 w0.15: v1(11.18,7.11) 11.68,6.6 44.32,6.6 44.58,6.86 45.34,6.86 v1(45.85,6.35)
  Bottom Layer w0.15: U17.38 5.37,24.93 4.38,23.95 4.38,12.13 3.23,10.98 3.23,6.55 3.69,6.09 10.28,6.09 11.18,6.98 v1(11.18,7.11)
SDA: length 77.7
  Top Layer w0.15: v1(10.67,5.84) 10.67,8.89 10.14,9.41 10.14,11.29 10.54,11.68 R17.1 ; CN2.2 44.83,5.14 v1(44.83,6.35)
  Inner1 w0.15: v1(10.67,5.84) 11.18,6.35 v1(44.83,6.35)
  Bottom Layer w0.15: U17.45 5.18,28.43 4.15,29.46 2.92,29.46 2.49,29.04 2.49,21.89 4.13,20.25 4.13,12.26 2.98,11.11 2.98,6.44 3.58,5.84 v1(10.67,5.84)
SPI_CLK: length 53
  Top Layer w0.15: v1(47.62,8.13) 48.83,8.13 U4.2
  Inner1 w0.15: 18.8,6.98 18.92,6.86 44.15,6.86 45.41,8.13 v1(47.62,8.13)
  Bottom Layer w0.15: v1(18.8,7.11) 17.73,7.11 17.01,7.83 17.01,10.5 15.32,12.19 11.81,12.19 11.39,12.61 U17.26
SPI_CSN: length 55.6
  Top Layer w0.15: v1(47.62,9.14) U4.3
  Inner1 w0.15: v1(18.8,7.75) 19.43,7.11 44.04,7.11 46.08,9.14 v1(47.62,9.14)
  Bottom Layer w0.15: U17.27 10.89,12.6 11.56,11.94 15.22,11.94 16.76,10.39 16.76,7.72 17.8,6.68 19,6.68 19.3,6.98 19.3,7.24 18.92,7.62
SPI_DIO: length 56.5
  Top Layer w0.15: v1(47.62,10.16) 48.83,10.16 U4.4
  Inner1 w0.15: v1(47.62,10.16) 46.74,10.16 43.94,7.37 19.81,7.37 19.43,7.75 v1(19.43,7.87)
  Bottom Layer w0.15: v1(19.43,7.87) 19.56,7.75 19.56,6.88 19.11,6.43 17.7,6.43 16.51,7.62 16.51,10.29 15.11,11.68 11.3,11.68 10.39,12.59 U17.28
SW: length 6.3
  Top Layer w0.4: 30.31,30.15 30.24,30.07 30.24,25.56 29.02,24.35
SWCLK: length 18.4
  Bottom Layer w0.15: 4.65,13.06 4.65,23.39 U17.37 ; H9.2 4.65,9.7 4.65,12.48 arc(4.64,12.76) 4.64,13.04
SWDIO: length 20.9
  Bottom Layer w0.15: H9.1 9.53,7.87 8.89,8.51 6.48,8.51 4.91,10.08 4.91,23.19 5.44,23.73 U17.36
TXD_2: length 42.5
  Top Layer w0.15: U2.4 25.91,12.59 v1(25.91,11.81)
  Inner1 w0.15: 25.91,11.94 v1(25.91,11.81) 25.65,11.55 5.16,11.55 4.57,12.14 4.57,15.22 3.3,16.49 v1(3.3,27.81)
  Bottom Layer w0.15: v1(3.3,27.81) 3.81,27.81 5.19,26.43 U17.41
TXD_3: length 30.5
  Top Layer w0.15: v1(26.42,42.42) 26.67,42.16 U7.7
  Inner1 w0.15: v1(26.42,42.42) 17.78,42.42 17.02,41.66 17.02,35.43 15.12,33.53 15.12,25.78 v1(14.73,25.4)
  Bottom Layer w0.15: U17.22 12.93,25.43 13.08,25.28 14.61,25.28 v1(14.73,25.4)
VB1: length 14.2
  Top Layer w0.2: C31.1 26.22,20.2 U1.20 23.95,20.19 22.35,20.19 21.75,19.59 21.75,14 20.83,13.08 20.4,13.08 19.76,12.45 18.96,12.45 18.8,12.61
VB2: length 10.2
  Top Layer w0.2: 20.96,12.61 22.05,13.71 22.05,17.86 22.44,18.25 U1.17 26.26,18.25 C32.1
VB3: length 7.5
  Top Layer w0.2: 23.11,12.61 22.35,13.38 22.35,15.49 23.16,16.3 26.31,16.3 C33.1
VCOMH: length 3.2
  Top Layer w0.2: 10.35,30.73 9.53,30.73 9.32,30.93 7.26,30.93 OLED1.27
VM: length 81.6
  Top Layer w0.2: v1(31.24,10.58) 30.56,9.91 24.17,9.91 23.11,8.85 D9.2 18.8,8.85
  Top Layer w0.25: 15.62,21.08 15.11,21.59 15.11,22.8 C29.2 14.1,26.22 13.97,26.35 15.88,26.35 C51.2 ; 15.62,21.08 23.88,21.08 24.38,21.59 24.38,22.5 24.87,22.99 U16.5 28.57,22.99 29.07,22.49 R41.1 29.34,22.22 v1(30.1,22.99) ; 15.62,21.08 15.62,19.75 C34.2 C35.2 17.17,16.3 18.21,16.3
  Inner2 w0.25: 34.42,22.86 34.29,22.99 v1(30.1,22.99)
  Inner2 w2: 35.56,14.48 35.56,13.21 33.44,11.08 v1(32.74,11.08) v1(32.24,11.08) v1(31.74,11.08)
  Bottom Layer w2: NOREF.1 35.43,9.02 33.37,11.08 v1(32.74,11.08) v1(32.24,11.08) v1(31.74,11.08) ; C27.1 42.92,17.15 C28.1 42.92,10.53 40.26,7.87 35.81,7.87 35.69,7.75
  vias: v1(31.24,11.58) v1(31.24,11.08) v1(31.74,11.58) v1(31.74,10.58) v1(32.24,11.58) v1(32.24,10.58) v1(32.74,11.58) v1(32.74,10.58) v1(33.24,11.58) v1(33.24,11.08) v1(33.24,10.58) v1(38.77,39.53) v1(38.77,38.73) v1(38.77,37.93) v1(38.77,37.13) v1(38.8,28.45) v1(38.8,27.65) v1(38.8,26.85) v1(38.8,26.05) v1(39.02,16.74) v1(39.02,15.94) v1(39.02,15.14) v1(39.02,14.34) v1(39.47,39.53) v1(39.47,38.73) v1(39.47,37.93) v1(39.47,37.13) v1(39.5,28.45) v1(39.5,27.65) v1(39.5,26.85) v1(39.5,26.05) v1(39.72,16.74) v1(39.72,15.94) v1(39.72,15.14) v1(39.72,14.34) v1(40.17,39.53) v1(40.17,38.73) v1(40.17,37.93) v1(40.17,37.13) v1(40.2,28.45) v1(40.2,27.65) v1(40.2,26.85) v1(40.2,26.05) v1(40.42,16.74) v1(40.42,15.94) v1(40.42,15.14) v1(40.42,14.34) v1(40.87,39.53) v1(40.87,38.73) v1(40.87,37.93) v1(40.87,37.13) v1(40.9,28.45) v1(40.9,27.65) v1(40.9,26.85) v1(40.9,26.05) v1(41.12,16.74) v1(41.12,15.94) v1(41.12,15.14) v1(41.12,14.34)

## Copper pours and planes (outline as drawn; the poured copper is in the pictures)
GND on Top Layer: 29.72,2.16 32,2.16 32,1.14 29.72,1.14
GND on Top Layer: -6.9,49.53 58.67,49.53 58.67,-6.73 -6.9,-6.73
GND on Top Layer: 37.49,35.12 40.67,35.12 40.67,31.75 37.49,31.75
GND on Top Layer: 22.1,23.31 23.78,23.31 23.78,22.68 22.1,22.68
GND on Top Layer: 37.34,23.82 40.51,23.82 40.51,20.45 37.34,20.45
GND on Top Layer: 37.37,12.26 40.54,12.26 40.54,8.89 37.37,8.89
GND on Bottom Layer: -6.39,49.4 59.18,49.4 59.18,-6.86 -6.39,-6.86
GND on Inner2: 50.26,22.32 52.74,22.32 52.74,17.62 50.26,17.62
GND on Inner2: -5.97,49.66 59.44,49.66 59.44,-6.48 -5.97,-6.48
A+ on Top Layer: 41.53,39.5 46.98,39.5 46.98,32.39 41.53,32.39
B+ on Top Layer: 41.53,28.19 46.98,28.19 46.98,21.08 41.53,21.08
C+ on Top Layer: 41.78,16.64 47.24,16.64 47.24,9.53 41.78,9.53
SW on Top Layer: 24.38,26.67 29.72,26.67 29.72,23.5 24.38,23.5
VM on Inner2: 36.7,29.08 41.53,29.08 41.53,25.4 36.7,25.4
VM on Inner2: 36.19,17.14 41.66,17.14 41.66,13.84 36.19,13.84
VM on Inner2: 36.7,40 41.53,40 41.53,36.58 36.7,36.58
VM on Inner2: 34,40.03 37.19,40.03 37.19,13.85 34,13.85

Small or netless copper shapes (teardrops, artwork), in the pictures only: 329 on Top Layer, 174 on Bottom Layer, 69 on Inner1, 5 on Inner2

## Text on the board
Bottom Silkscreen Layer: + | - | RS485 | +5V | 485_A | 485_B | GND | PB6 | PB9 | PB12 | PC6 | DIO | CSN | CLK | 3V3 | CAN | CANH | CANL | IIC | SDA | SCL | PWR | PC13 | RST | KEY1 | KEY2 | KEY3 | KEY4 | SPI | OLED | POWER | DC 8V-24V | STM32G431CBU6 | Designed | BY | PC10 | PC11 | SWIO | SWCK | V2.1 | 24/9/16 | KOBE_FOC | Dai Jize | 10K | 0.1uF | 12pF | 22pF | 1K | 1uF
Document Layer: 因为布局问题，采样电阻和放大器的距离有一些远，采样效果有点差， / 所以这个版本不适合电流闭环，电流开环的情况下速度环和位置环的效果也还能接受 | REF3033 | 10K | 2.2uF | 0.1uF | 910K | 1uF | 100R | 4.7uF | 5K1 | 0R | 22uF | EG2133 | 1K | FR107 | ME6211 | 47pF | 120R | ME3116 | 6.8uH / 0420 | 1N5819W | SMFJ3.3 | LM321
